# EAGLE design SLA_1500_CAM_V4 (EAGLE 9.2.1)
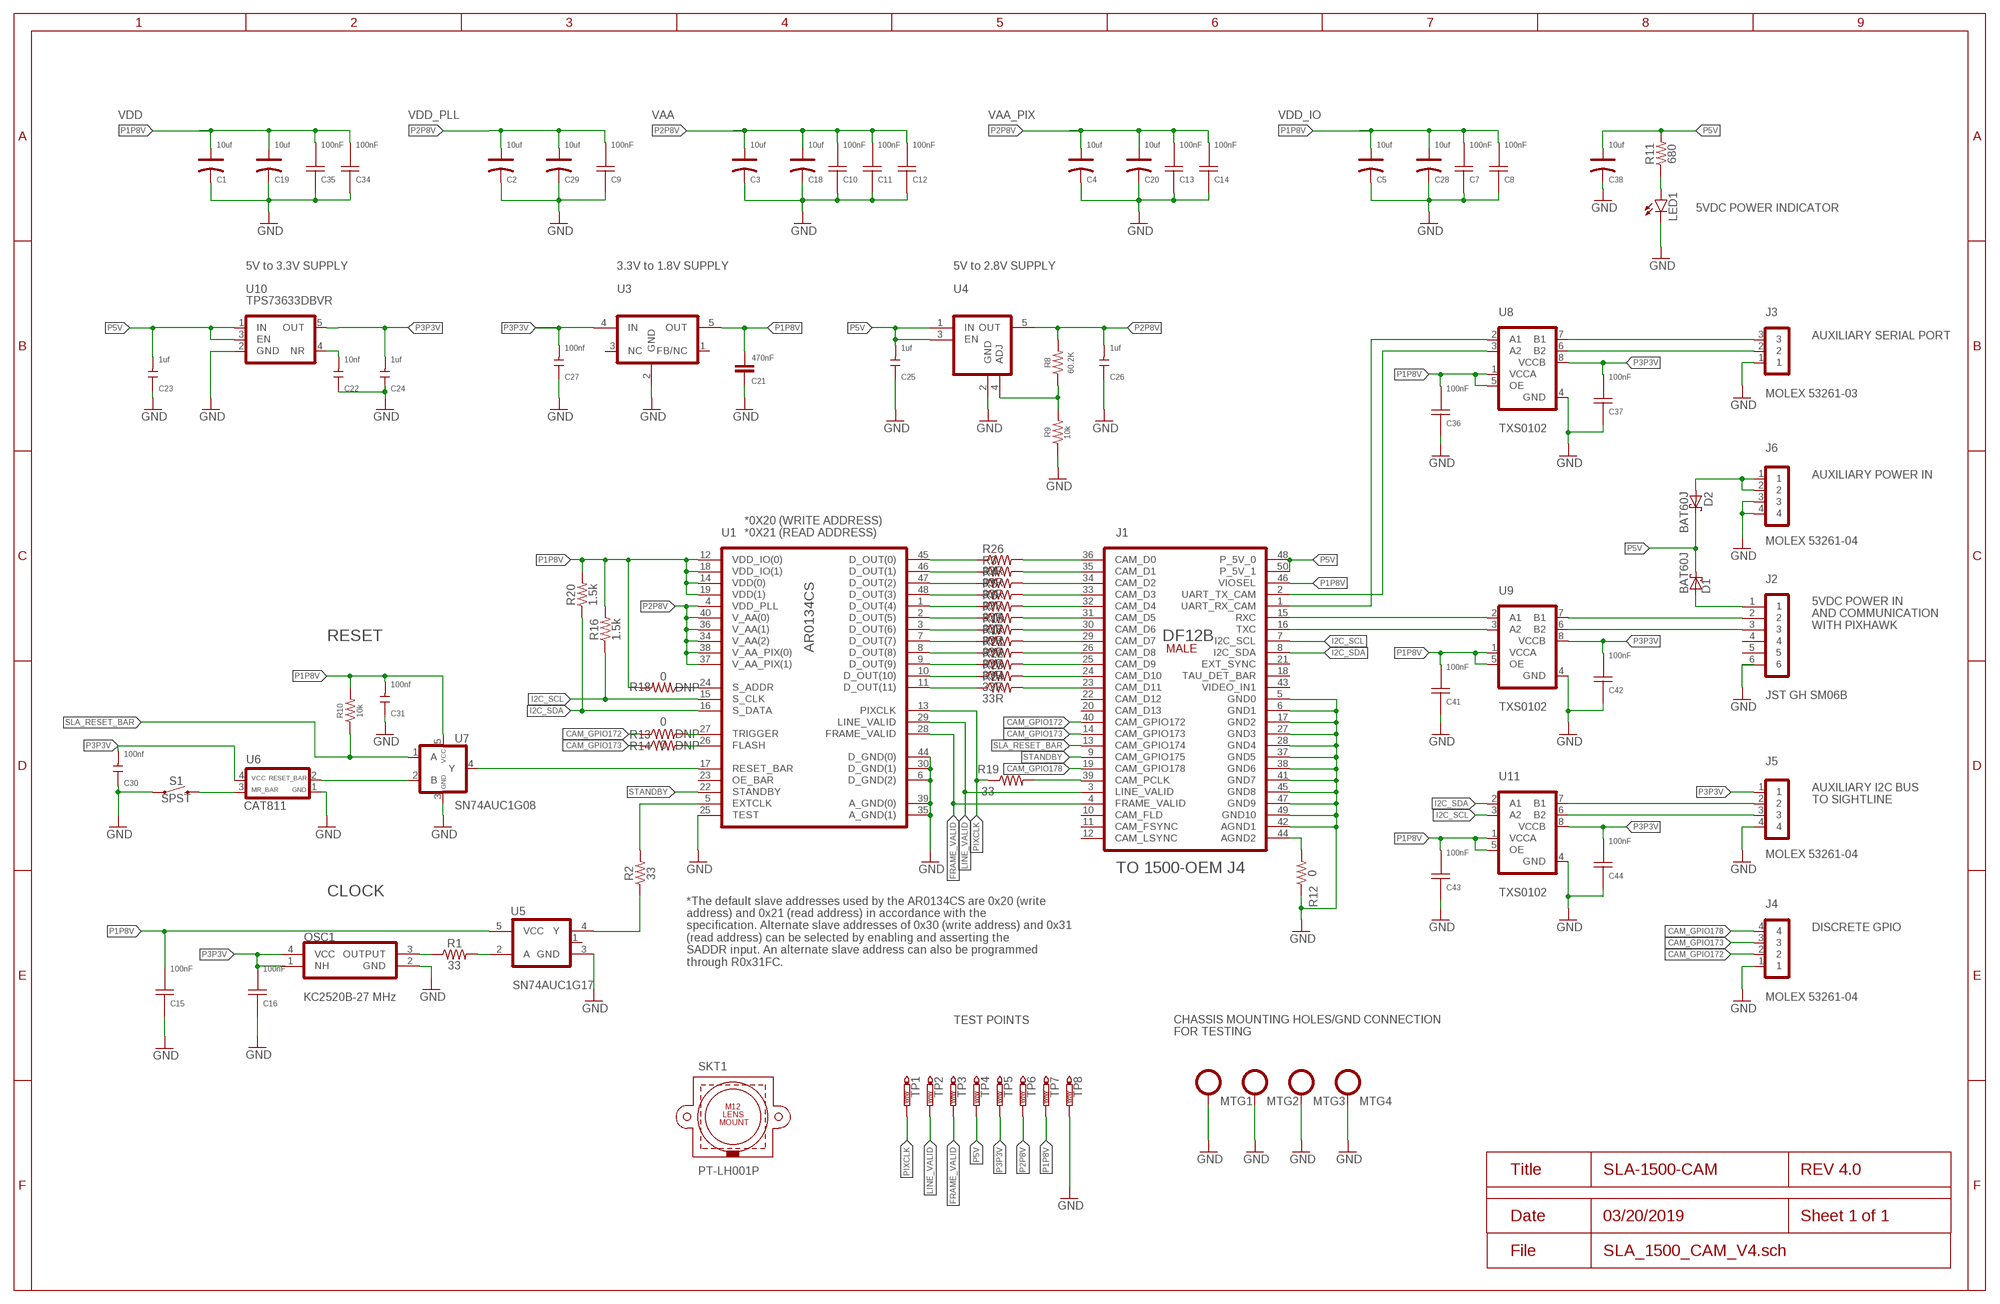
[diagram p0: schematic, sheet 1]
FRAME1 (FRAME_B_L): SPICEPREFIX: X

## Parts
C1  10uf  TANTALUM-SMD-10UF-10V-10%(AVX-A)  [AVX-A]
C2  10uf  TANTALUM-SMD-10UF-10V-10%(AVX-A)  [AVX-A]
C3  10uf  TANTALUM-SMD-10UF-10V-10%(AVX-A)  [AVX-A]
C4  10uf  TANTALUM-SMD-10UF-10V-10%(AVX-A)  [AVX-A]
C5  10uf  TANTALUM-SMD-10UF-10V-10%(AVX-A)  [AVX-A]
C7  CAP0201100NF  [R0201]
C8  CAP0201100NF  [R0201]
C9  CAP0201100NF  [R0201]
C10  CAP0201100NF  [R0201]
C11  CAP0201100NF  [R0201]
C12  CAP0201100NF  [R0201]
C13  CAP0201100NF  [R0201]
C14  CAP0201100NF  [R0201]
C15  CAP0201100NF  [R0201]
C16  CAP0201100NF  [R0201]
C18  10uf  TANTALUM-SMD-10UF-10V-10%(AVX-A)  [AVX-A]
C19  10uf  TANTALUM-SMD-10UF-10V-10%(AVX-A)  [AVX-A]
C20  10uf  TANTALUM-SMD-10UF-10V-10%(AVX-A)  [AVX-A]
C21  470nF  470NF-0402-16V-10%  [0402]
C22  10nf  CERAMIC-10NF-50V-10%-X7R(0402)  [C0402]
C23  1uf  CERAMIC-1UF-10V-10%-X5R(0402)  [C0402]
C24  1uf  CERAMIC-1UF-10V-10%-X5R(0402)  [C0402]
C25  1uf  CERAMIC-1UF-10V-10%-X5R(0402)  [C0402]
C26  1uf  CERAMIC-1UF-10V-10%-X5R(0402)  [C0402]
C27  100nf  CERAMIC-100NF-25V-10%-X7R(0402)  [C0402]
C28  10uf  TANTALUM-SMD-10UF-10V-10%(AVX-A)  [AVX-A]
C29  10uf  TANTALUM-SMD-10UF-10V-10%(AVX-A)  [AVX-A]
C30  100nf  CERAMIC-100NF-25V-10%-X7R(0402)  [C0402]
C31  100nf  CERAMIC-100NF-25V-10%-X7R(0402)  [C0402]
C34  CAP0201100NF  [R0201]
C35  CAP0201100NF  [R0201]
C36  CAP0201100NF  [R0201]
C37  CAP0201100NF  [R0201]
C38  10uf  TANTALUM-SMD-10UF-10V-10%(AVX-A)  [AVX-A]
C41  CAP0201100NF  [R0201]
C42  CAP0201100NF  [R0201]
C43  CAP0201100NF  [R0201]
C44  CAP0201100NF  [R0201]
D1  BAT60J  [SOD323_ST]
D2  BAT60J  [SOD323_ST]
J1  DF12B(5.0)-50DS-0.5(86)SMT  [DF12B(5.0)-50DS-0.5V(86)]
J2  JST GH SM06B  JST_GH_SM06B-GHS-TB  [JST_SM06B-GHS-TB]
J3  MOLEX 53261-03  MOLEX53261-03  [53261-03]
J4  MOLEX 53261-04  MOLEX53261-04  [53261-04]
J5  MOLEX 53261-04  MOLEX53261-04  [53261-04]
J6  MOLEX 53261-04  MOLEX53261-04  [53261-04]
LED1  LEDCHIP-LED0603  [CHIP-LED0603]
MTG1  SLA_MOUNTING  [SLA_MOUNTING]
MTG2  SLA_MOUNTING  [SLA_MOUNTING]
MTG3  SLA_MOUNTING  [SLA_MOUNTING]
MTG4  SLA_MOUNTING  [SLA_MOUNTING]
OSC1  KC2520B-27MHZ  [2.5X2.0_SMDCRYSTAL]
R1  33  RESISTOR0402  [0402]
R2  33  RESISTOR0402  [0402]
R3  33R  R-US_R0201  [R0201]
R4  33R  R-US_R0201  [R0201]
R5  33R  R-US_R0201  [R0201]
R6  33R  R-US_R0201  [R0201]
R7  33R  R-US_R0201  [R0201]
R8  60.2K  62KOHM-0603-1/10W-5%  [0603]
R9  10k  10KOHM-0603-1/10W-1%  [0603]
R10  10k  10KOHM-0603-1/10W-1%  [0603]
R11  680  680OHM-0603-1/10W-5%  [0603]
R12  0  RESISTOR0402  [0402]
R13  0  RESISTOR0402  [0402]
R14  0  RESISTOR0402  [0402]
R15  33R  R-US_R0201  [R0201]
R16  1.5k  1.5KOHM-0603-1/10W-1%  [0603]
R17  33R  R-US_R0201  [R0201]
R18  0  RESISTOR0402  [0402]
R19  33  RESISTOR0402  [0402]
R20  1.5k  1.5KOHM-0603-1/10W-1%  [0603]
R21  33R  R-US_R0201  [R0201]
R22  33R  R-US_R0201  [R0201]
R23  33R  R-US_R0201  [R0201]
R24  33R  R-US_R0201  [R0201]
R26  33R  R-US_R0201  [R0201]
S1  SPST  MOMENTARY-SWITCH-SPST-SMD-4.6X2.8MM  [TACTILE_SWITCH_SMD_4.6X2.8MM]
SKT1  PT-LH001P  M12_LENS_MOUNT  [M12_HOLDER]
TP1  PTR1PAD1-13  [P1-13]
TP2  PTR1PAD1-13  [P1-13]
TP3  PTR1PAD1-13  [P1-13]
TP4  PTR1PAD1-13  [P1-13]
TP5  PTR1PAD1-13  [P1-13]
TP6  PTR1PAD1-13  [P1-13]
TP7  PTR1PAD1-13  [P1-13]
TP8  PTR1PAD1-13  [P1-13]
U1  AR0134CS-ILCC48  [ILCC48_KD]
U3  TPS71518DCKR  [TI-SC70-5]
U4  AP7331-WG-7  [SOT-25]
U5  SN74AUC1G17  [SOT23-5]
U6  CAT811  [SOT-143-4]
U7  SN74AUC1G08  [SOT23-5]
U8  TXS0102  TXS0102DQM  [X2SON(8)1.8X1.2MM]
U9  TXS0102  TXS0102DQM  [X2SON(8)1.8X1.2MM]
U10  TPS73633DBVR  [SOT23-5]
U11  TXS0102  TXS0102DQM  [X2SON(8)1.8X1.2MM]

## Nets
CAM_GPIO172: J1.40(CAM_GPIO172) J4.2 R13.1
CAM_GPIO173: J1.14(CAM_GPIO173) J4.3 R14.1
CAM_GPIO178: J1.19(CAM_GPIO178) J4.4
FRAME_VALID: J1.4(FRAME_VALID) TP3.TP U1.28(FRAME_VALID)
GND: C1.- C2.- C3.- C4.- C5.- C7.2 C8.2 C9.2 C10.2 C11.2 C12.2 C13.2 C14.2 C15.2 C16.2 C18.- C19.- C20.- C21.2 C22.1 C23.1 C24.1 C25.1 C26.1 C27.1 C28.- C29.- C30.1 C31.1 C34.2 C35.2 C36.2 C37.2 C38.- C41.2 C42.2 C43.2 C44.2 J1.5(GND0) J1.6(GND1) J1.17(GND2) J1.27(GND3) J1.28(GND4) J1.37(GND5) J1.38(GND6) J1.41(GND7) J1.42(AGND1) J1.45(GND8) J1.47(GND9) J1.49(GND10) J2.6 J3.1 J4.1 J5.4 J6.3 J6.4 LED1.C MTG1.P$1 MTG2.P$1 MTG3.P$1 MTG4.P$1 OSC1.2(GND) R9.1 R12.1 S1.1 S1.2 TP8.TP U1.6(D_GND(2)) U1.25(TEST) U1.30(D_GND(1)) U1.35(A_GND(1)) U1.39(A_GND(0)) U1.44(D_GND(0)) U3.2(GND) U4.2(GND) U5.3(GND) U6.1(GND) U7.3(GND) U8.4(GND) U9.4(GND) U10.2(GND) U11.4(GND)
I2C_SCL: J1.7(I2C_SCL) R16.1 U1.15(S_CLK) U11.3(A2)
I2C_SDA: J1.8(I2C_SDA) R20.1 U1.16(S_DATA) U11.2(A1)
LINE_VALID: J1.3(LINE_VALID) TP2.TP U1.29(LINE_VALID)
N$1: J2.3 U9.6(B2)
N$2: R26.1 U1.45(D_OUT(0))
N$3: J1.36(CAM_D0) R26.2
N$4: R3.1 U1.46(D_OUT(1))
N$5: J1.35(CAM_D1) R3.2
N$6: R4.1 U1.47(D_OUT(2))
N$7: J1.34(CAM_D2) R4.2
N$8: R5.1 U1.48(D_OUT(3))
N$9: J1.33(CAM_D3) R5.2
N$10: R6.1 U1.1(D_OUT(4))
N$11: J1.32(CAM_D4) R6.2
N$12: R7.1 U1.2(D_OUT(5))
N$13: J3.3 U8.7(B1)
N$14: J1.31(CAM_D5) R7.2
N$15: R1.2 U5.2(A)
N$16: OSC1.3(OUTPUT) R1.1
N$17: J2.2 U9.7(B1)
N$18: J3.2 U8.6(B2)
N$19: J1.1(UART_RX_CAM) U8.2(A1)
N$20: J1.2(UART_TX_CAM) U8.3(A2)
N$21: C22.2 U10.4(NR)
N$22: R15.1 U1.3(D_OUT(6))
N$23: R8.1 R9.2 U4.4(ADJ)
N$24: J1.30(CAM_D6) R15.2
N$25: R2.1 U5.4(Y)
N$26: R2.2 U1.5(EXTCLK)
N$27: S1.3 S1.4 U6.3(MR_BAR)
N$28: U6.2(RESET_BAR) U7.2(B)
N$29: U1.17(RESET_BAR) U7.4(Y)
N$30: LED1.A R11.1
N$31: J1.44(AGND2) R12.2
N$32: R13.2 U1.27(TRIGGER)
N$33: R14.2 U1.26(FLASH)
N$34: D1.A J2.1
N$35: J1.15(RXC) U9.2(A1)
N$36: J1.16(TXC) U9.3(A2)
N$37: J5.2 U11.7(B1)
N$38: J5.3 U11.6(B2)
N$39: D2.A J6.1 J6.2
N$40: R17.1 U1.7(D_OUT(7))
N$41: J1.29(CAM_D7) R17.2
N$42: R21.1 U1.8(D_OUT(8))
N$43: J1.26(CAM_D8) R21.2
N$44: R22.1 U1.9(D_OUT(9))
N$45: J1.25(CAM_D9) R22.2
N$46: R23.1 U1.10(D_OUT(10))
N$47: J1.24(CAM_D10) R23.2
N$48: R24.1 U1.11(D_OUT(11))
N$49: J1.23(CAM_D11) R24.2
N$52: R18.1 U1.24(S_ADDR)
N$53: J1.39(CAM_PCLK) R19.2
P1P8V: C1.+ C5.+ C7.1 C8.1 C15.1 C19.+ C21.1 C28.+ C31.2 C34.1 C35.1 C36.1 C41.1 C43.1 J1.46(VIOSEL) R10.2 R16.2 R18.2 R20.2 TP7.TP U1.12(VDD_IO(0)) U1.14(VDD(0)) U1.18(VDD_IO(1)) U1.19(VDD(1)) U3.5(OUT) U5.5(VCC) U7.5(VCC) U8.1(VCCA) U8.5(OE) U9.1(VCCA) U9.5(OE) U11.1(VCCA) U11.5(OE)
P2P8V: C2.+ C3.+ C4.+ C9.1 C10.1 C11.1 C12.1 C13.1 C14.1 C18.+ C20.+ C26.2 C29.+ R8.2 TP6.TP U1.4(VDD_PLL) U1.34(V_AA(2)) U1.36(V_AA(1)) U1.37(V_AA_PIX(1)) U1.38(V_AA_PIX(0)) U1.40(V_AA(0)) U4.5(OUT)
P3P3V: C16.1 C24.2 C27.2 C30.2 C37.1 C42.1 C44.1 J5.1 OSC1.1(NH) OSC1.4(VCC) TP5.TP U3.4(IN) U6.4(VCC) U8.8(VCCB) U9.8(VCCB) U10.5(OUT) U11.8(VCCB)
P5V: C23.2 C25.2 C38.+ D1.C D2.C J1.48(P_5V_0) J1.50(P_5V_1) R11.2 TP4.TP U4.1(IN) U4.3(EN) U10.1(IN) U10.3(EN)
PIXCLK: R19.1 TP1.TP U1.13(PIXCLK)
SLA_RESET_BAR: J1.13(CAM_GPIO174) R10.1 U7.1(A)
STANDBY: J1.9(CAM_GPIO175) U1.22(STANDBY)
Unconnected: J1.10(CAM_FLD) J1.11(CAM_FSYNC) J1.12(CAM_LSYNC) J1.18(TAU_DET_BAR) J1.20(CAM_D13) J1.21(EXT_SYNC) J1.22(CAM_D12) J1.43(VIDEO_IN1) J2.4 J2.5 U1.23(OE_BAR) U3.1(FB/NC) U3.3(NC) U5.1(NC)

## Notes on the sheet
- VDD | VDD_PLL | VAA | VAA_PIX | VDD_IO
- 5VDC POWER INDICATOR
- 5V to 3.3V SUPPLY | 3.3V to 1.8V SUPPLY | 5V to 2.8V SUPPLY
- AUXILIARY SERIAL PORT
- AUXILIARY POWER IN
- *0X20 (WRITE ADDRESS)
  *0X21 (READ ADDRESS)
- 5VDC POWER IN 
  AND COMMUNICATION 
  WITH PIXHAWK
- RESET
- DNP
- DNP
- DNP
- AUXILIARY I2C BUS 
  TO SIGHTLINE
- TO 1500-OEM J4
- CLOCK
- DISCRETE GPIO
- *The default slave addresses used by the AR0134CS are 0x20 (write
  address) and 0x21 (read address) in accordance with the
  specification. Alternate slave addresses of 0x30 (write address) and 0x31 
  (read address) can be selected by enabling and asserting the
  SADDR input. An alternate slave address can also be programmed
  through R0x31FC.
- TEST POINTS
- CHASSIS MOUNTING HOLES/GND CONNECTION
  FOR TESTING

## Library data of the parts
C1-C5 C18-C20 C28 C29 C38 = Seeed-Capacitor:TANTALUM-SMD-10UF-10V-10%(AVX-A): 302020011; MPN: TAJA106K010RNJ
C7-C16 C34-C37 C41-C44 = Sightline:CAP0201: CAP0201 PANASONIC CERAMIC CAPACITOR CAP, CERAMIC, 100nF, 10V, X5R, 20%, 0201; DESCRIPTION: CAP, CERAMIC, 100nF, 10V, X5R, 20%, 0201; MANF: PANASONIC; MANF#: ECJZEB1A104M
C21 = SparkFun-Capacitors:470NF: 0.47uF/470nF ceramic capacitors A capacitor is a passive two-terminal electrical component used to store electrical energy temporarily in an electric field.; PROD_ID: CAP-09041
C22 = Seeed-Capacitor:CERAMIC-10NF-50V-10%-X7R(0402): 302010006; MPN: CC0402KRX7R9BB103
C23-C26 = Seeed-Capacitor:CERAMIC-1UF-10V-10%-X5R(0402): 302010040; MPN: CC0402KRX5R6BB105
C27 C30 C31 = Seeed-Capacitor:CERAMIC-100NF-25V-10%-X7R(0402): 302010024; MPN: CC0402KRX7R8BB104
D1 D2 = diode:BAT60J: Schottky barrier diode Source: www.st.com, BAT60J.pdf
J1 = Sightline:DF12B(5.0)-50DS-0.5(86): DF12B(5.0)-50DS-0.5(86) DF12 Series 0.5 mm Pitch SMT Board-to-Board Connector (MALE) Specifications Manufacturer: Hirose Manufacturer Part Number: 537-0309-6 86 Operating Temperature Range(C): -45 - 125 Current Rating: 0.3A Voltage Rating: 50V AC Body Size(mm): 14.6 x 3.6 DF12B(5.0)-50DS DATASHEET <https://www.hirose.com/product/en/products/DF12/> Created by: Kimball S. Davis kimball4@pdx.edu <mailto: kimball4@pdx.edu> 21 January 2019 Version 001; DESCRIPTION: DF12B-50DS-0.5V(86) Hirose Male 50-pin connector; MANF: Hirose; MANF#: 537-0309-6 86
J2 = Sightline:JST_GH_SM06B-GHS-TB: JST SM06B-GHS-TB JST Type GH 1.25mm side-entry smt 6-pin connector Specifications Manufacturer: JST Manufacturer Part Number: SM06B-GHS-TB Body Size(mm): 10.75 X 4.25 JST TYPE GH DATASHEET <http://www.jst-mfg.com/product/pdf/eng/eGH.pdf> Created by: Kimball S. Davis 5 February 2019 Version 001; DESCRIPTION: 1.25 MM SIDE-ENTRY 6-PIN SMT CONNECTOR; MANF: JST; MANF#: SM06B-GHS-TB
J3 = Sightline:MOLEX53261-03: MOLEX 53261-03 1.25mm Pitch PicoBlade Header, Surface Mount, Right-Angle, 3 Circuits, Tin (Sn) Plating 53261-03 DATASHEET <https://www.molex.com/webdocs/datasheets/pdf/en-us/0532610371_PCB_HEADERS.pdf>; DESCRIPTION: 1.25mm Pitch PicoBlade Header, Surface Mount, Right-Angle, 3 Circuits, Tin (Sn) Plating; MANF: MOLEX; MANF#: 532610371
J4-J6 = Sightline:MOLEX53261-04: MOLEX 53261-04 1.25mm Pitch PicoBlade Header, Surface Mount, Right-Angle, 4 Circuits, Tin (Sn) Plating 53261-04 DATASHEET <https://www.molex.com/webdocs/datasheets/pdf/en-us/0532610471_PCB_HEADERS.pdf>; DESCRIPTION: 1.25mm Pitch PicoBlade Header, Surface Mount, Right-Angle, 4 Circuits, Tin (Sn) Plating; MANF: MOLEX; MANF#: 532610471
LED1 = led:LED: LED OSRAM: - CHIPLED LG R971, LG N971, LY N971, LG Q971, LY Q971, LO R971, LY R971 LH N974, LH R974 LS Q976, LO Q976, LY Q976 LO Q996 - Hyper CHIPLED LW Q18S LB Q993, LB Q99A, LB R99A - SideLED LS A670, LO A670, LY A670, LG A670, LP A670 LB A673, LV A673, LT A673, LW A673 LH A674 LY A675 LS A676, LA A676, LO A676, LY A676, LW A676 LS A679, LY A679, LG A679 - Hyper Micro SIDELED® LS Y876, LA Y876, LO Y876, LY Y876 LT Y87S - SmartLED LW L88C, LW L88S LB L89C, LB L89S, LG L890 LS L89K, LO L89K, LY L89K LS L896, LA L896, LO L896, LY L896 - TOPLED LS T670, LO T670, LY T670, LG T670, LP T670 LSG T670, LSP T670, LSY T670, LOP T670, LYG T670 LG T671, LOG T671, LSG T671 LB T673, LV T673, LT T673, LW T673 LH T674 LS T676, LA T676, LO T676, LY T676, LB T676, LH T676, LSB T676, LW T676 LB T67C, LV T67C, LT T67C, LS T67K, LO T67K, LY T67K, LW E67C LS E67B, LA E67B, LO E67B, LY E67B, LB E67C, LV E67C, LT E67C LW T67C LS T679, LY T679, LG T679 LS T770, LO T770, LY T770, LG T770, LP T770 LB T773, LV T773, LT T773, LW T773 LH T774 LS E675, LA E675, LY E675, LS T675 LS T776, LA T776, LO T776, LY T776, LB T776 LHGB T686 LT T68C, LB T68C - Hyper Mini TOPLED® LB M676 - Mini TOPLED Santana® LG M470 LS M47K, LO M47K, LY M47K Source: http://www.osram.convergy.de LUXEON: - LUMILED® LXK2-PW12-R00, LXK2-PW12-S00, LXK2-PW14-U00, LXK2-PW14-V00 LXK2-PM12-R00, LXK2-PM12-S00, LXK2-PM14-U00 LXK2-PE12-Q00, LXK2-PE12-R00, LXK2-PE12-S00, LXK2-PE14-T00, LXK2-PE14-U00 LXK2-PB12-K00, LXK2-PB12-L00, LXK2-PB12-M00, LXK2-PB14-N00, LXK2-PB14-P00, LXK2-PB14-Q00 LXK2-PR12-L00, LXK2-PR12-M00, LXK2-PR14-Q00, LXK2-PR14-R00 LXK2-PD12-Q00, LXK2-PD12-R00, LXK2-PD12-S00 LXK2-PH12-R00, LXK2-PH12-S00 LXK2-PL12-P00, LXK2-PL12-Q00, LXK2-PL12-R00 Source: www.luxeon.com KINGBRIGHT: KA-3528ASYC Source: www.kingbright.com
MTG1-MTG4 = Sightline:SLA_MOUNTING
OSC1 = Sightline:KC2520B-27MHZ: KC2520B-27MHz-2.5X2.0 27 MHz SMT Clock Oscillator with CMOS output Specifications Manufacturer: Kyocera Manufacturer Part Number: KC2520B27.0000C2GE00 Supply Voltage: 1.8 to 3.3V Body Size(mm): 2.5 x 2.0 KC2520B DATASHEET <https://www.mouser.com/datasheet/2/909/kc2520b_c1_e-1388834.pdf> Created by: Kimball S. Davis 25 January 2019 Version 001; DESCRIPTION: OSC, CRYSTAL CLOCK, SMD, CMOS, 2.25V TO 3.63V, 4mA, 27.0000MHz, 2.5MM x 2.0MM; MANF: Kyocera; MANF#: KC2520B27.0000C2GE00
R1 R2 R12-R14 R18 R19 = SparkFun-Resistors:RESISTOR: Generic Resistor Package
R3-R7 R15 R17 R21-R24 R26 = resistor:R-US_: RESISTOR, American symbol
R8 = SparkFun-Resistors:62KOHM: 62kΩ resistor A resistor is a passive two-terminal electrical component that implements electrical resistance as a circuit element. Resistors act to reduce current flow, and, at the same time, act to lower voltage levels within circuits. - Wikipedia
R9 R10 = SparkFun-Resistors:10KOHM: 10kΩ resistor A resistor is a passive two-terminal electrical component that implements electrical resistance as a circuit element. Resistors act to reduce current flow, and, at the same time, act to lower voltage levels within circuits. - Wikipedia; PROD_ID: RES-00824
R11 = SparkFun-Resistors:680OHM: 680Ω resistor A resistor is a passive two-terminal electrical component that implements electrical resistance as a circuit element. Resistors act to reduce current flow, and, at the same time, act to lower voltage levels within circuits. - Wikipedia; PROD_ID: RES-09333
R16 R20 = SparkFun-Resistors:1.5KOHM: 1.5kΩ resistor A resistor is a passive two-terminal electrical component that implements electrical resistance as a circuit element. Resistors act to reduce current flow, and, at the same time, act to lower voltage levels within circuits. - Wikipedia; PROD_ID: RES-08306
S1 = SparkFun-Switches:MOMENTARY-SWITCH-SPST: Momentary Switch (Pushbutton) - SPST Normally-open (NO) SPST momentary switches (buttons, pushbuttons). Variants PTH-12MM - 12mm square, through-hole Momentary Pushbutton Switch - 12mm Square <https://www.sparkfun.com/products/9190> (COM-09190) PTH-6.0MM, PTH-6.0MM-KIT - 6.0mm square, through-hole Mini Pushbutton Switch <https://www.sparkfun.com/products/97> (COM-00097) KIT package intended for soldering kit's - only one side of pads' copper is exposed. PTH-RIGHT-ANGLE-KIT - Right-angle, through-hole Right Angle Tactile Button <https://www.sparkfun.com/products/10791> - Used on SparkFun BigTime Watch Kit <https://www.sparkfun.com/products/11734> SMD-12MM - 12mm square, surface-mount Tactile Button - SMD (12mm) <https://www.sparkfun.com/products/12993> (COM-12993) Used on SparkFun PicoBoard <https://www.sparkfun.com/products/11888> SMD-4.5MM - 4.5mm Square Trackball Switch Used on SparkFun Blackberry Trackballer Breakout <https://www.sparkfun.com/products/13169> SMD-4.6MMX2.8MM - 4.60mm x 2.80mm, surface mount Used on SparkFun SAMD21 Mini Breakout <https://www.sparkfun.com/products/13664> SMD-5.2MM, SMD-5.2-REDUNDANT - 5.2mm square, surface-mount Mini Pushbutton Switch - SMD <https://www.sparkfun.com/products/8720> (COM-08720) Used on Arduino Pro Mini <https://www.sparkfun.com/products/11114> REDUNDANT package connects both switch circuits together SMD-6.0X3.5MM - 6.0 x 3.5mm, surface mount Momentary Reset Switch SMD <https://www.sparkfun.com/products/8229> (COM-08229) SMD-6.2MM-TALL - 6.2mm square, surface mount Tactile Button - SMD (6mm) <https://www.sparkfun.com/products/12992> Used on SparkFun Digital Sandbox <https://www.sparkfun.com/products/12651> SMD-RIGHT-ANGLE - Right-angle, surface mount Used on SparkFun Block for Intel® Edison - Arduino <https://www.sparkfun.com/products/13036>; PROD_ID: SWCH-13065
SKT1 = Sightline:M12_LENS_MOUNT: PT-LH001P PT-LH001P Plastic M12 Lens Holder, 20mm Hole Spacing; DESCRIPTION: PT-LH001P Plastic M12 Lens Holder, 20mm Hole Spacing; MANF: M12 LENSES; MANF#: PT-LH001P
TP1-TP8 = testpad:PTR1: TEST PIN
U1 = Sightline:AR0134CS-ILCC48: AR0134CS-1LCC48-10x10 1/3-inch 1.2 Mp CMOS digital image sensor with an active-pixel array of 1280 (H) × 960 (V) Specifications Manufacturer: On Semiconductor Manufacturer Part Number: AR0134CSSM00SPCA0 Operating Temperature Range(C): -30 - 70 Supply Voltage: I/O: 1.8 or 2.8V Digital: 1.8V Analog: 2.8V HiSPi: 0.4V Body Size(mm): 10 x 10 ARO134CS DATASHEET <https://www.onsemi.com/pub/Collateral/AR0134CS-D.PDF> Created by: Kimball S. Davis kimball4@pdx.edu <mailto: kimball4@pdx.edu> 22 January 2019 Version 001; DESCRIPTION: 1/3-inch 1.2 Mp CMOS digital image sensor with an active-pixel array of 1280 (H) × 960 (V); MANF: On Semiconductor; MANF#: AR0134CSSM00SPCA0
U3 = Sightline:TPS71518DCKR: TPS71518DCKR 50-mA, 24-V, 3.2-μA Supply Current Low-Dropout Linear Regulator in SC70 5-Pin Package, 3.3 to 1.8V, 2.15 x 1.4mm TPS71518DCKR DATASHEET <http://www.ti.com/lit/ds/symlink/tps715.pdf>; DESCRIPTION: 50-mA, 24-V, 3.2-μA Supply Current Low-Dropout Linear Regulator in SC70 5-Pin Package, 3.3 to 1.8V, 2.15 x 1.4mm; MANF: TEXAS INSTRUMENTS; MANF#: TPS71518DCKR
U4 = Sightline:AP7331-WG-7: AP7331-WG-7 300mA, LOW QUIESCENT CURRENT, FAST TRANSIENT LOW DROPOUT LINEAR REGULATOR, ADJUSTABLE OUTPUT, 5V to 2.8V, 3.1 x 1.7mm AP7331 DATASHEET <https://www.diodes.com/assets/Datasheets/AP7331.pdf>; DESCRIPTION: 300mA, LOW QUIESCENT CURRENT, FAST TRANSIENT LOW DROPOUT LINEAR REGULATOR, ADJUSTABLE OUTPUT, 5V to 2.8V, 3.1 x 1.7mm; MANF: DIODES INCORPORATED; MANF#: AP7331-WG-7
U5 = Sightline:SN74AUC1G17: SN74AUC1G17-SOT23-5 IC, BUFFER, SINGLE SCHMITT-TRIGGER, 9mA, 0.8V TO 2.7V, SOT23-5 Specifications Manufacturer: Texas Instruments Manufacturer Part Number: SN74AUC1G17DBVR Supply Voltage: 3.6V Max Body Size(mm): 2.9 x 1.6 SN74AUC1G17 DATASHEET <http://www.ti.com/lit/ds/symlink/sn74auc1g17.pdf> Created by: Kimball S. Davis 24 January 2019 Version 001; DESCRIPTION: IC, BUFFER, SINGLE SCHMITT-TRIGGER, 9mA, 0.8V TO 2.7V, SOT23-5; MANF: TEXAS INSTRUMENTS; MANF#: SN74AUC1G17DBV
U6 = Sightline:CAT811: CAT811-SOT-143-4 IC, SUPERVISOR, MICROPROCESSOR POWER SUPPLY, 2.93V, ACTIVE LOW RESET, SOT143-4 Specifications Manufacturer: On Semiconductor Manufacturer Part Number: CAT811STBI Body Size(mm): 2.9 x 1.3 CAT811 DATASHEET <https://www.onsemi.com/pub/Collateral/CAT811-D.PDF> Created by: Kimball S. Davis 23 January 2019 Version 001; DESCRIPTION: IC, SUPERVISOR, MICROPROCESSOR POWER SUPPLY, 2.93V, ACTIVE LOW RESET, SOT143-4; MANF: On Semiconductor; MANF#: CAT811STBI
U7 = Sightline:SN74AUC1G08: SN74AUC1G08-SOT23-5 Single 2-Input Positive-AND Gate Specifications Manufacturer: Texas Instruments Manufacturer Part Number: SN74AUC1G08DBVR Supply Voltage: 1.65 - 1.95V Body Size(mm): 2.9 x 1.6 SN74AUC1G08 DATASHEET <http://www.ti.com/lit/ds/symlink/sn74auc1g08.pdf>; DESCRIPTION: IC, AND GATE, SINGLE, 2 INPUT POSITIVE, SGL, SOT23-5; MANF: Texas Instruments; MANF#: SN74AUC1G08DBVR
U8 U9 U11 = Sightline:TXS0102DQM: TXS0102DQM 1.8 X 1.2 mm TXS0102 2-Bit Bidirectional Voltage-Level Translator TXS0102 DATASHEET <http://www.ti.com/lit/ds/symlink/txs0102.pdf>; DESCRIPTION: TXS0102 2-Bit Bidirectional Voltage-Level Translator for Open-Drain and Push-Pull Applications; MANF: Texas Instruments; MANF#: TXS0102DQM
U10 = Sightline:TPS73633DBVR: TPS73633DBVR Cap-Free, NMOS, 400-mA Low-Dropout Regulator with Reverse Current Protection 5.5 to 3.3V, SOT-23 5-pin, 2.9 x 1.6 mm TPS73633DBVR DATASHEET <http://www.ti.com/lit/ds/symlink/tps736.pdf>; DESCRIPTION: Cap-Free, NMOS, 400-mA Low-Dropout Regulator with Reverse Current Protection 5.5 to 3.3V, SOT-23 5-pin, 2.9 x 1.6 mm; MANF: Texas Instruments; MANF#: TPS73633DBVR

## Board
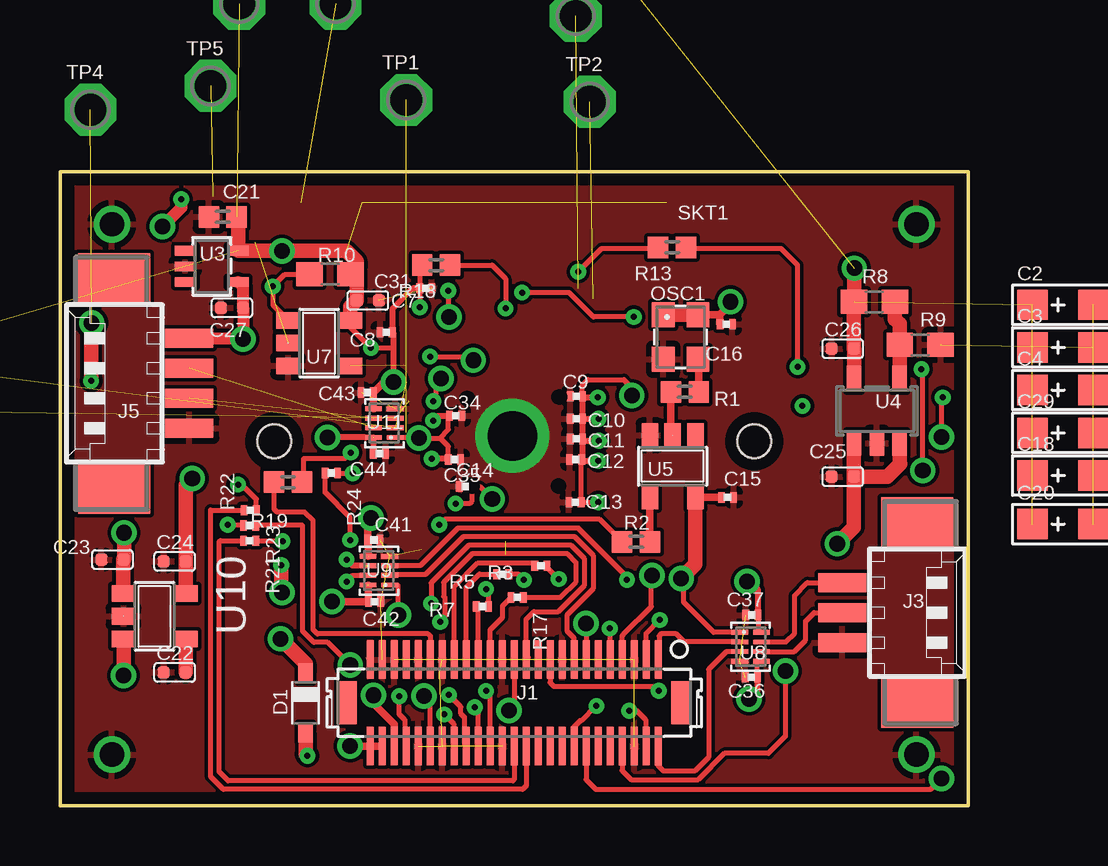
[diagram p1: board, top side]
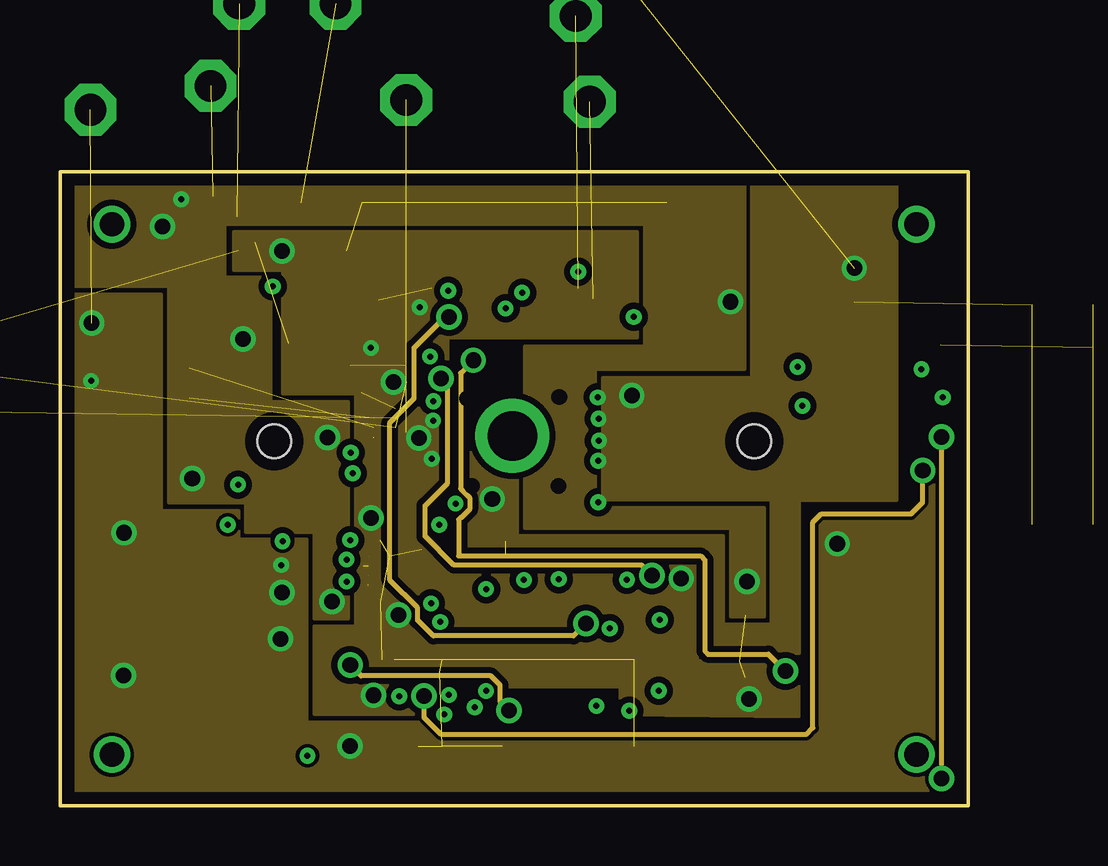
[diagram p2: board, inner layer Route2]
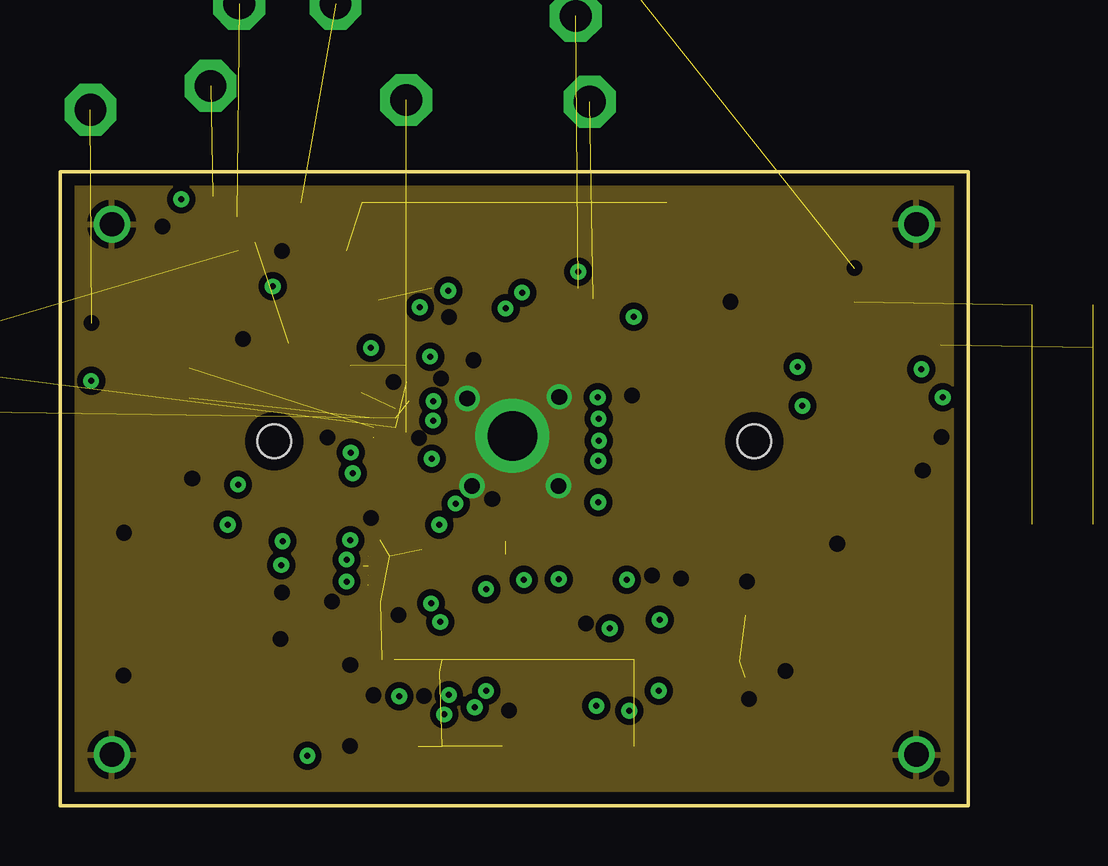
[diagram p3: board, inner layer Route15]
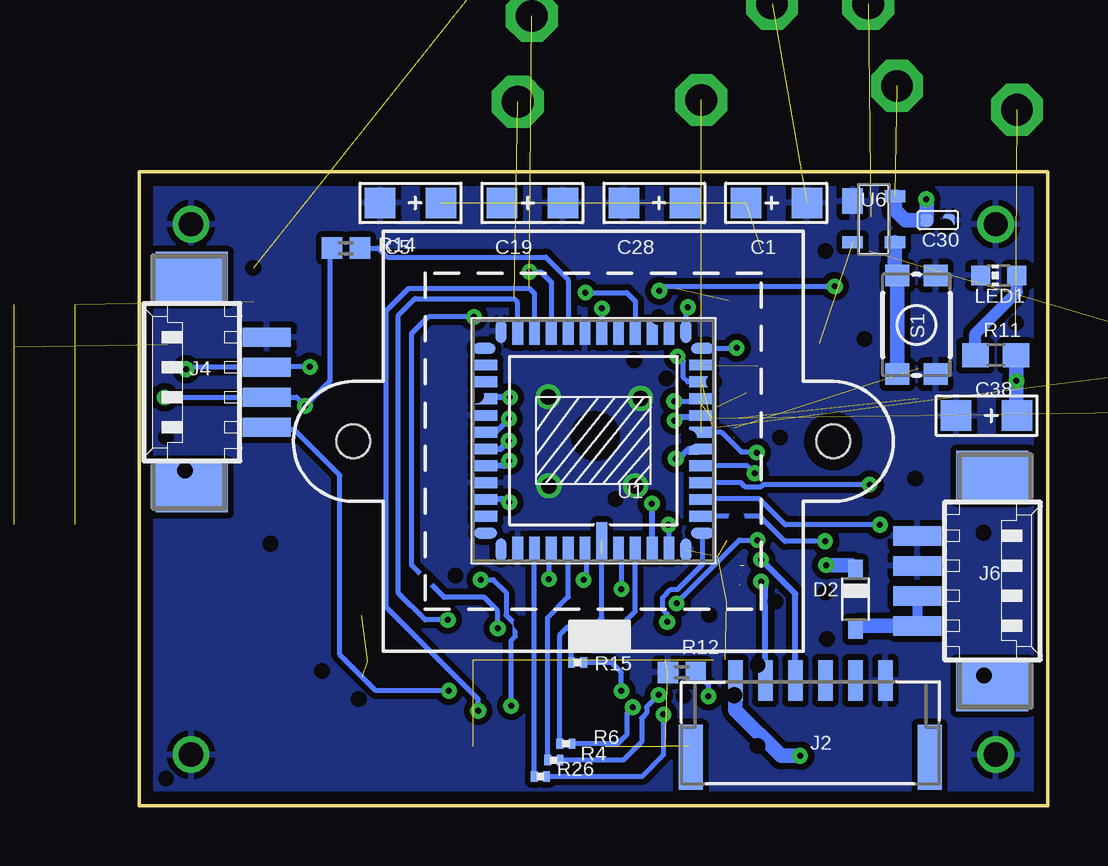
[diagram p4: board, bottom side, seen from below]

Size 37.85 x 26.42 mm. Coordinates in mm from the lower left corner, seen from the top.
Outline: 0,0 0.18,0
Outline: 0.18,0 37.85,0 37.85,26.42 0,26.42 0,0
Outline: 0,0 0.18,0
Copper layers ([2:[15:1+2*15+16:2]:15]): Top 0.0178mm / dielectric 12mil / Route2 0.0356mm / dielectric 28mil / Route15 0.0356mm / dielectric 12mil / Bottom 0.0178mm
Design rules "SSC-EAGLE-4Lyr_v1.0.0.3 *": minimum track width 6mil, minimum drill 8mil, track to track 6mil, track to pad 6mil, pad to pad 6mil, via to via 6mil, smd to smd 6mil, copper to edge 20mil, drill to drill 16mil, minimum pad ring 8mil, minimum via ring 8mil, stop-mask expansion 3mil, vias tented up to drill 0mil, thermal gap 10mil

### Footprints (pad centres in the part's own frame; a part is rotated, then mirrored left to right if it is on the bottom)
AVX-A = smd 1.27 x 1.27: + -1.27,0; - 1.27,0
R0201 = smd 0.28 x 0.43: 1 -0.255,0; 2 0.255,0
0402 = smd 0.85 x 0.9: 1 -0.58,0; 2 0.58,0
C0402 = smd 0.5 x 0.5: 1 0,0.463; 2 0,-0.463
SOD323_ST = smd 0.8 x 0.6: A 1.25,0; C -1.25,0
DF12B(5.0)-50DS-0.5V(86) = smd 1.6 x 0.3: 1 -1.8,6; 2 1.8,6; 3 -1.8,5.5; 4 1.8,5.5; 5 -1.8,5; 6 1.8,5; 7 -1.8,4.5; 8 1.8,4.5; 9 -1.8,4; 10 1.8,4; 11 -1.8,3.5; 12 1.8,3.5; 13 -1.8,3; 14 1.8,3; 15 -1.8,2.5; 16 1.8,2.5; 17 -1.8,2; 18 1.8,2; 19 -1.8,1.5; 20 1.8,1.5; 21 -1.8,1; 22 1.8,1; 23 -1.8,0.5; 24 1.8,0.5; 25 -1.8,0; 26 1.8,0; 27 -1.8,-0.5; 28 1.8,-0.5; 29 -1.8,-1; 30 1.8,-1; 31 -1.8,-1.5; 32 1.8,-1.5; 33 -1.8,-2; 34 1.8,-2; 35 -1.8,-2.5; 36 1.8,-2.5; 37 -1.8,-3; 38 1.8,-3; 39 -1.8,-3.5; 40 1.8,-3.5; 41 -1.8,-4; 42 1.8,-4; 43 -1.8,-4.5; 44 1.8,-4.5; 45 -1.8,-5; 46 1.8,-5; 47 -1.8,-5.5; 48 1.8,-5.5; 49 -1.8,-6; 50 1.8,-6 | smd 1.8 x 0.8: P$51 0,6.95; P$52 0,-6.95
JST_SM06B-GHS-TB = smd 0.6 x 1.7: 1 -3.23,1.95; 2 -1.98,1.95; 3 -0.73,1.95; 4 0.52,1.95; 5 1.77,1.95; 6 3.02,1.95 | smd 1 x 2.7: P$7 -5.08,-1.25; P$8 4.87,-1.25
53261-03 = smd 0.8 x 2: 1 1.25,-2.5; 2 0,-2.5; 3 -1.25,-2.5 | smd 2.1 x 3: S1 3.75,0.625; S2 -3.75,0.625
53261-04 = smd 0.8 x 2: 1 1.875,-2.5; 2 0.625,-2.5; 3 -0.625,-2.5; 4 -1.875,-2.5 | smd 2.1 x 3: S1 4.375,0.625; S2 -4.375,0.625
CHIP-LED0603 = smd 0.8 x 0.8: A 0,-0.75; C 0,0.75
SLA_MOUNTING = drill 1.016: P$1 0,0
2.5X2.0_SMDCRYSTAL = smd 1.05 x 0.95: 1 -0.925,-0.725; 2 0.925,-0.725; 3 0.925,0.725; 4 -0.925,0.725
0603 = smd 1.1 x 1: 1 -0.85,0; 2 0.85,0
TACTILE_SWITCH_SMD_4.6X2.8MM = smd 0.9 x 1: 1 -2.05,-0.8; 2 2.05,-0.8; 3 2.05,0.8; 4 -2.05,0.8
M12_HOLDER = hole 1.4: -10,0; 10,0
P1-13 = drill 1.321 pad 2.159 octagon: TP 0,0
ILCC48_KD = smd 0.45 x 1.6: 1 -0.35,4.2 | smd 0.45 x 1: 2 -1.05,4.5; 3 -1.75,4.5; 4 -2.45,4.5; 5 -3.15,4.5; 20 -3.15,-4.5; 21 -2.45,-4.5; 22 -1.75,-4.5; 23 -1.05,-4.5; 24 -0.35,-4.5; 25 0.35,-4.5; 26 1.05,-4.5; 27 1.75,-4.5; 28 2.45,-4.5; 29 3.15,-4.5; 44 3.15,4.5; 45 2.45,4.5; 46 1.75,4.5; 47 1.05,4.5; 48 0.35,4.5 | smd 0.45 x 0.95: 6 -3.85,4.55; 19 -3.85,-4.55; 30 3.85,-4.55; 43 3.85,4.55 | smd 0.95 x 0.45: 7 -4.55,3.85; 18 -4.55,-3.85; 31 4.55,-3.85; 42 4.5,3.85 | smd 1 x 0.45: 8 -4.5,3.15; 9 -4.5,2.45; 10 -4.5,1.75; 11 -4.5,1.05; 12 -4.5,0.35; 13 -4.5,-0.35; 14 -4.5,-1.05; 15 -4.5,-1.75; 16 -4.5,-2.45; 17 -4.5,-3.15; 32 4.5,-3.15; 33 4.5,-2.45; 34 4.5,-1.75; 35 4.5,-1.05; 36 4.5,-0.35; 37 4.5,0.35; 38 4.5,1.05; 39 4.5,1.75; 40 4.5,2.45; 41 4.5,3.15
TI-SC70-5 = smd 0.4 x 0.9: 1 -0.65,-1.1; 2 0,-1.1; 3 0.65,-1.1; 4 0.65,1.1; 5 -0.65,1.1
SOT-25 = smd 0.6 x 1.05: 1 -0.95,-1.35; 2 0,-1.35; 3 0.95,-1.35; 4 0.95,1.35; 5 -0.95,1.35
SOT23-5 = smd 0.69 x 0.99: 1 -0.95,-1.29; 2 0,-1.29; 3 0.95,-1.29; 4 0.95,1.3; 5 -0.95,1.3
SOT-143-4 = smd 1.06 x 0.85: 1 -0.76,-0.88 | smd 0.5 x 0.85: 2 0.96,-0.88; 3 0.96,0.88; 4 -0.96,0.88
X2SON(8)1.8X1.2MM = smd 0.2 x 0.7: 1 -0.6,-0.45; 2 -0.2,-0.45; 3 0.2,-0.45; 4 0.6,-0.45; 5 0.6,0.45; 6 0.2,0.45; 7 -0.2,0.45; 8 -0.6,0.45

### Placement (x,y rotation side)
C1  11.3,25.12 0 bottom
C2  41.78,20.88 0 top
C3  41.78,19.1 0 top
C4  41.78,17.32 0 top
C5  26.54,25.12 180 bottom
C7  15.24,21.56 0 top
C8  13.59,19.74 180 top
C9  21.51,17.07 180 top
C10  21.51,16.13 180 top
C11  21.51,15.29 180 top
C12  21.49,14.43 180 top
C13  21.46,12.65 180 top
C14  16.89,13.31 180 top
C15  27.81,12.85 0 top
C16  27.76,20.07 0 top
C18  41.78,13.77 0 top
C19  21.46,25.12 0 bottom
C20  41.78,11.73 0 top
C21  6.78,24.54 180 top
C22  4.78,5.56 90 top
C23  2.18,10.26 90 top
C24  4.78,10.19 90 top
C25  32.61,13.72 90 top
C26  32.61,19.05 90 top
C27  7.16,20.75 90 top
C28  16.38,25.12 180 bottom
C29  41.78,15.54 0 top
C30  4.57,24.41 270 bottom
C31  12.83,21.06 270 top
C34  16.48,16.26 0 top
C35  16.43,14.43 0 top
C36  28.8,5.36 180 top
C37  28.83,7.95 180 top
C38  2.54,16.26 180 bottom
C41  13.08,11.07 0 top
C42  13.11,8.51 0 top
C43  12.8,17.22 180 top
C44  13.31,14.68 0 top
D1  10.24,4.29 270 top
D2  8,8.61 270 bottom
J1  18.92,4.29 270 top
J2  9.78,3.28 0 bottom
J3  35.1,8.05 270 top
J4  35.03,17.65 90 bottom
J5  2.9,17.6 90 top
J6  2.92,9.37 270 bottom
LED1  2.03,22.1 90 bottom
MTG1  2.16,2.13 0 top
MTG2  35.69,2.13 0 top
MTG3  35.69,24.23 0 top
MTG4  2.16,24.23 0 top
OSC1  25.86,19.53 270 top
R1  26.03,17.25 180 top
R2  24,11 180 top
R3  20.04,10.01 180 top
R4  20.57,1.91 0 bottom
R5  18.44,9.65 180 top
R6  20.07,2.59 0 bottom
R7  17.6,8.31 180 top
R8  33.93,21.01 180 top
R9  35.84,19.2 180 top
R10  11.25,22.15 0 top
R11  2.16,18.77 0 bottom
R12  15.24,5.56 0 bottom
R13  25.5,23.27 180 top
R14  29.24,23.24 0 bottom
R15  19.58,5.97 0 bottom
R16  -8.43,16.48 0 top  (outside the outline)
R17  19.05,8.69 180 top
R18  15.67,22.53 180 top
R19  9.5,13.49 180 top
R20  -8.41,18.72 0 top  (outside the outline)
R21  7.9,11.05 180 top
R22  7.9,11.68 0 top
R23  7.92,12.32 180 top
R24  11.3,13.87 180 top
R26  21.13,1.22 0 bottom
S1  5.46,20.04 90 bottom
SKT1  18.92,15.18 0 bottom
TP1  14.43,29.41 0 top
TP2  22.07,29.34 0 top
TP3  21.49,32.92 0 top  (outside the outline)
TP4  1.27,29.01 0 top
TP5  6.27,30 0 top  (outside the outline)
TP6  21.77,36.68 0 top  (outside the outline)
TP7  7.47,33.43 0 top  (outside the outline)
TP8  11.48,33.43 0 top  (outside the outline)
U1  18.92,15.21 180 bottom
U3  6.32,22.48 270 top
U4  34.04,16.46 0 top
U5  25.53,14.15 180 top
U6  7.24,24.43 270 bottom
U7  10.79,19.28 270 top
U8  28.78,6.63 270 top
U9  13.28,9.8 90 top
U10  3.94,7.9 270 top
U11  13.51,15.95 90 top

### Tracks (layer width: path | path; a pad name or v marks a point on that pad's centre or on a via)
CAM_GPIO172  (via drill 0.25, 0.65 layers 1-2)
  Top 0.203: J1.40 15.42,4.31 v15.16,4.57 | v30.73,18.29 30.73,22.53 30.05,23.22 26.13,23.22 R13.1 | v35.95,13.97 35.95,18.13 v35.89,18.19
  Route2 0.203: v35.95,13.97 35.95,12.65 35.55,12.26 35.46,12.17 31.72,12.17 31.37,11.81 31.37,3.25 31.09,2.97 15.89,2.97 15.16,3.7 v15.16,4.57
  Bottom 0.203: v30.73,18.29 31.93,18.29 31.94,18.28 J4.2 32.54,18.29 35.89,18.29 v35.89,18.19
CAM_GPIO173  (via drill 0.25, 0.65 layers 1-2)
  Top 0.203: J1.14 21.92,1.09 22.33,0.69 36.28,0.69 v36.73,1.14 | v36.73,15.37 36.73,16.97 v36.78,17.02
  Route2 0.203: v36.73,1.14 v36.73,15.37
  Bottom 0.203: R14.1 29.84,23.27 29.9,23.27 29.9,17.7 v30.94,16.66 31.3,17.03 J4.3 36.77,17.03 v36.78,17.02
CAM_GPIO178  (via drill 0.25)
  Top 0.203: J1.19 20.42,5.13 20.57,4.98 24.76,4.98 v24.94,4.8
  Bottom 0.203: v24.94,4.8 27.99,4.8 29.49,6.3 29.49,13.77 31.39,15.67 31.8,15.67 31.91,15.78 J4.4
FRAME_VALID  (via drill 0.25)  (1 unrouted)
  Top 0.203: J1.4 24.4,2.52 24.4,3.59 24.03,3.96 v23.72,3.96
  Bottom 0.203: U1.28 21.39,19.73 21.39,21.36 21.59,21.56 26.62,21.56 27.56,20.62 27.56,8.28 23.72,4.44 v23.72,3.96
GND  (via drill 0.65 layers 15-16, 2.06 layers 1-15)  (25 unrouted)
  Top 0.508: J5.4 5.44,15.69 | C21.2 6.18,24.51
  Bottom 0.254: 6.22,10 J6.3 | J6.4 6.13,11.25 6.22,11.15
  Bottom 0.305: J2.6 6.73,5.25 | 5.35,11.18 J6.4
  Bottom 0.508: 5.46,11.29 J6.4 | S1.1 4.51,18.14 | 4.51,21.94 S1.2
  other vias: 20.78,13.34 20.8,17.04 16.97,16.97 17.17,13.34 18.85,15.42
  pour Route15 (isolate 0.254): -0.38,26.64 -0.38,-0.53 38.23,-0.53 38.23,26.9 -0.38,26.9
  pour Bottom (isolate 0.254): -0.38,26.9 38.23,26.9 38.23,-0.53 -0.38,-0.53 -0.38,-0.28
  pour Top (isolate 0.152): -0.66,27.15 -0.66,-0.79 38.51,-0.79 38.51,27.15
I2C_SCL  (via drill 0.25, 0.65 layers 1-2)  (2 unrouted)
  Top 0.203: v15.87,17.81 15.66,17.59 15.66,16.96 v15.56,16.86 | J1.7 23.42,7.08 23.49,7.15 23.49,7.16 24.64,8.31 24.64,9.58 v24.66,9.6
  Route2 0.203: v24.66,9.6 24.23,10.03 16.41,10.03 15.22,11.22 15.22,12.51 16.15,13.45 16.15,17.53 v15.87,17.81
  Bottom 0.203: v15.56,16.86 14.53,16.86 U1.15
I2C_SDA  (via drill 0.25, 0.65 layers 1-2)  (2 unrouted)
  Top 0.203: J1.8 23.42,1.47 23.8,1.09 26.59,1.09 27.69,2.19 29.52,2.19 30.22,2.89 v30.22,5.61 | v15.42,18.72 17.07,18.72 v17.22,18.57
  Route2 0.203: v17.22,18.57 16.69,18.03 16.69,13.21 17.06,12.84 17.06,12.36 16.72,12.01 16.69,12.01 16.61,11.94 16.61,10.41 26.7,10.41 26.87,10.24 26.87,6.45 26.97,6.35 26.97,6.32 29.52,6.32 v30.22,5.61
  Bottom 0.203: U1.16 15,17.66 15.18,17.84 15.18,18.54 15.35,18.72 v15.42,18.72
LINE_VALID  (via drill 0.25)  (1 unrouted)
  Top 0.203: J1.3 24.42,7.17 v24.99,7.74
  Bottom 0.203: v24.99,7.74 25.93,7.74 27.05,8.86 27.05,20.45 26.36,21.13 22.22,21.13 22.1,21.01 22.1,19.74 U1.29
N$1  (via drill 0.25)  (1 unrouted)
  Top 0.254: 12.63,10 12.19,10 v11.94,10.26
  Bottom 0.254: J2.3 10.51,8.83 v11.94,10.26
N$2
  Bottom 0.203: R26.1 21.39,10.7 U1.45
N$3  (via drill 0.25)
  Top 0.203: 16.4,2.47 J1.36 16.42,3.39 v16,3.81
  Bottom 0.203: v16,3.81 16,2.11 16.9,1.22 R26.2
N$4  (via drill 0.25)
  Top 0.203: R3.1 20.3,9.93 v20.78,9.45
  Bottom 0.203: U1.46 20.78,10.61 v20.78,9.45
N$5
  Top 0.203: 16.45,6.12 J1.35 16.42,9.13 17.41,10.12 19.67,10.12 R3.2
N$6
  Bottom 0.203: U1.47 | R4.1 20.83,7.85 19.96,8.71 U1.47
N$7  (via drill 0.25)
  Top 0.203: 16.95,2.52 J1.34 16.85,2.57 16.85,3.7 16.7,3.85 16.7,4.12 v16.2,4.62
  Bottom 0.203: v16.2,4.62 16.7,4.12 16.7,3.87 16.92,3.66 16.92,2.67 17.68,1.9 R4.2
N$8  (via drill 0.25)
  Top 0.203: v19.33,9.41 19.09,9.65 R5.1
  Bottom 0.203: v19.33,9.41 19.22,9.52 19.22,10.66 U1.48
N$9
  Top 0.203: J1.33 16.92,9.1 17.47,9.65 R5.2
N$10  (1 unrouted)
  Bottom 0.203: U1.1 | R6.1 20.32,7.14 20,7.46 18.94,7.46 18.57,7.83 18.57,10.49
N$11  (via drill 0.25)
  Top 0.203: J1.32 17.42,3.97 v17.28,4.11
  Bottom 0.203: v17.28,4.11 17.53,3.87 17.53,2.97 17.91,2.59 R6.2
N$12  (via drill 0.25)
  Top 0.203: R7.1 17.86,8.93 v17.75,9.03
  Bottom 0.203: U1.2 17.75,10.6 v17.75,9.03
N$13
  Top 0.203: U8.7 30.25,6.83 30.61,7.19 30.61,8.76 31.15,9.3 J3.3
N$14
  Top 0.203: J1.31 17.42,8.23 R7.2
N$15
  Top 0.305: R1.2 25.45,15.51 U5.2
N$16
  Top 0.305: R1.1 26.61,18.57 OSC1.3
N$17  (via drill 0.25)  (1 unrouted)
  Top 0.203: v11.94,9.35 12.2,9.61 U9.7
  Bottom 0.254: J2.2 11.76,9.17 v11.94,9.35
N$18
  Top 0.203: U8.6 30.59,6.43 31.06,6.91 31.06,7.7 31.42,8.05 J3.2
N$19
  Top 0.203: U8.2 26.01,6.83 25.68,7.16 25.04,7.16 24.97,7.09 24.97,6.14 J1.1
N$20
  Top 0.203: U8.3 27.77,6.43 27.03,5.69 27.03,2.03 26.44,1.45 25.15,1.45 24.92,1.67 J1.2
N$21
  Top 0.61: C22.2 U10.4
N$22
  Bottom 0.203: U1.3 17.17,8.11 17.69,7.59 18.31,7.59 18.79,7.1 19.62,7.1 19.84,6.88 R15.1
N$23
  Top 0.61: U4.4 R9.2 34.99,20.08 34.78,20.28 R8.1
N$24  (via drill 0.25)
  Top 0.203: J1.30 17.92,4.62 v17.75,4.79
  Bottom 0.203: v17.75,4.79 17.75,5.56 18.16,5.97 R15.2
N$25
  Top 0.305: R2.1 U5.4
N$26  (via drill 0.25)
  Top 0.203: R2.2 22.48,11.94 16.03,11.94 v15.8,11.71
  Bottom 0.203: v15.8,11.71 15.77,11.68 15.77,11.22 U1.5
N$27
  Bottom 0.508: S1.3 6.36,22.19
  Bottom 0.61: 6.36,22.19 U6.3 | S1.4 S1.3
N$28  (1 unrouted)
N$29  (1 unrouted)
N$30
  Bottom 0.508: R11.1 3.01,19.67 1.28,21.4 LED1.A
N$31  (via drill 0.25)
  Top 0.203: J1.44 14.37,2.54 14.37,3.59 14.13,3.83 v14.13,4.56
  Bottom 0.203: R12.2 14.13,5.03 v14.13,4.56
N$32  (via drill 0.25)
  Top 0.203: R13.2 24.92,23.22 22.55,23.22 v21.59,22.25
  Bottom 0.203: v21.59,22.25 21.11,22.25 20.68,21.82 U1.27
N$33
  Bottom 0.203: R14.2 27.89,23.24 27.51,22.86 20.9,22.86 19.97,21.93 U1.26
N$34  (via drill 0.25)
  Top 0.61: D1.A 10.24,2.16 v10.31,2.08
  Bottom 0.61: v10.31,2.08 11.1,2.08 13.01,3.99 J2.1
N$35
  Top 0.203: U9.2 13.76,9.63 15.22,9.63 16.81,11.21 20.42,11.21 | 20.55,11.21 20.42,11.21 | J1.15 21.42,6.99 21.14,7.27 21.14,7.97 22.24,9.07 22.24,10.41 21.44,11.21 20.42,11.21
N$36  (via drill 0.25)
  Top 0.203: v22.35,4.16 21.73,3.55 21.67,3.55 21.42,3.3 J1.16 | U9.3 15.02,10 16.58,11.57 21.6,11.57 23.62,9.55 v23.62,9.42
  Bottom 0.203: v22.35,4.16 22.35,6.88 22.17,7.06 22.17,7.57 22.55,7.95 22.55,8.89 23.09,9.42 v23.62,9.42
N$37  (1 unrouted)
N$38  (1 unrouted)
N$39
  Bottom 0.406: J6.2 J6.1 | D2.A 7.86,7.5
  Bottom 0.61: 7.86,7.5 J6.1
N$40  (via drill 0.25)
  Top 0.203: R17.1 20.85,8.69 21.51,9.34 21.51,10.14 21.15,10.5 17.17,10.5 15.99,9.31 15.99,8.73 16.04,8.67 16.04,7.86 v15.84,7.66
  Bottom 0.203: v15.84,7.66 15.84,7.99 16.04,8.19 16.04,8.67 15.7,9.01 15.41,9.01 14.37,10.06 U1.7
N$41
  Top 0.203: 17.97,6.14 J1.29 17.92,7.33 18.44,7.85 18.44,8.33 R17.2
N$42  (via drill 0.25)
  Top 0.203: R21.1 9.25,11.05 v9.27,11.02
  Bottom 0.203: v9.27,11.02 10.95,11.02 11.99,12.06 U1.8
N$43
  Top 0.203: J1.26 18.92,1.09 18.87,1.04 7.01,1.04 6.63,1.42 6.63,11 6.68,11.05 R21.2
N$44  (via drill 0.25)
  Top 0.203: R22.1 7.01,11.68 v6.98,11.71
  Bottom 0.203: v6.98,11.71 10.92,11.71 12.01,12.8 14.39,12.8 U1.9
N$45  (via drill 0.65 layers 1-2)
  Top 0.203: J1.25 18.92,4.19 v18.7,3.97 | v12.09,5.87 11.15,6.81 10.58,6.81 10.11,7.28 10.11,11.68 R22.2
  Route2 0.203: v18.7,3.97 18.34,4.34 18.34,5.03 17.95,5.42 12.55,5.42 v12.09,5.87
N$46  (via drill 0.25)
  Top 0.203: R23.1 8.18,12.78 7.57,13.39 v7.42,13.39
  Bottom 0.203: v7.42,13.39 11.85,13.39 11.96,13.28 12.59,13.28 12.78,13.46 U1.10
N$47
  Top 0.203: J1.24 19.42,0.83 19.28,0.69 6.81,0.69 6.27,1.22 6.27,12.32 R23.2
N$48  (via drill 0.25)
  Top 0.203: R24.1 v12.19,13.87 v12.2,13.86
  Bottom 0.203: v12.2,13.86 12.5,14.16 U1.11
N$49  (via drill 0.25)
  Top 0.203: v15.46,8.43 15.46,9.29 17.03,10.85 21.29,10.85 21.86,10.29 21.86,9.2 20.76,8.09 19.75,8.09 19.42,7.76 J1.23 | J1.23 19.52,6.19 J1.23 | v12.09,11.07 12.09,12.01 11.05,13.06 R24.2
  Bottom 0.203: v15.46,8.43 15.46,8.47 12.85,11.07 v12.09,11.07
N$52  (via drill 0.25)
  Top 0.203: R18.1 18.01,22.53 18.57,21.97 v18.57,20.73
  Bottom 0.203: v18.57,20.73 v18.57,20.72 U1.24
N$53
  Top 0.203: J1.39 15.43,7.07 15.33,7.17 10.72,7.17 10.55,7.35 10.55,11.88 10.18,12.24 9.04,12.24 8.92,12.37 R19.2
P1P8V  (via drill 0.25, 0.65 layers 1-2)  (8 unrouted)
  Top 0.203: U9.1 14.07,9.2 14.07,7.98 v14.1,7.95 | U8.1 27.24,7.23 25.98,8.48 25.98,9.37 v25.88,9.47 | C36.1 29.06,6.03 U8.5 | R18.2 14.98,22.42 C7.1 v14.98,20.78 v14.99,20.78 | 13.89,19.1 13.87,19.08 v12.96,19.08 12.09,19.94 U7.5 | U11.1 14.93,15.35 v14.95,15.33 15.83,15.33 | 15.83,15.33 16.18,15.67 | 16.18,15.67 | 16.18,15.67 16.18,16.23 | C35.1 16.18,14.98 15.83,15.33
  Top 0.254: v13.89,17.65 13.89,19.1 13.89,19.68 C8.1 13.84,20.7 14.71,21.56 C7.1 | 16.2,16.23 C34.1 16.2,16.23 | C35.1 16.15,14.45 15.5,14.45 v15.49,14.46 | 16.2,16.23 16.18,16.23 15.72,16.23 v15.54,16.05 | C36.1 29.06,4.8 v28.7,4.44
  Top 0.305: J1.46 13.92,3.41 13.11,4.22 13.11,4.61 v13.06,4.61 | U5.5 C15.1 | U9.5 C41.1 12.83,11.86 v12.95,11.99 | U11.5 C43.1 13.49,17.65 v13.89,17.65
  Top 0.61: C21.1 7.42,24.54 U3.5 9.25,23.13 | 9.25,23.13 v9.25,23.11 | 9.25,23.13 11.92,23.13 12.36,22.7 12.36,22.4 R10.2 12.36,21.89 C31.2 12.09,20.79 U7.5 | v25.88,9.47 26.48,10.07 U5.5
  Bottom 0.203: v14.99,20.78 15.07,20.69 U1.19 | U1.18 12.97,19.06 v12.96,19.08
  Bottom 0.254: U1.18 | U1.14 14.47,16.21 15.54,16.21 v15.54,16.05 | U1.12 14.52,14.76 14.96,14.76 14.96,14.87 15.38,14.45 15.39,14.46 v15.49,14.46
  pour Route2 (isolate 0.254): 7.24,23.93 7.24,22.33 9.27,22.33 9.27,17.17 12.32,17.17 12.32,7.49 10.59,7.49 10.59,3.81 14.73,3.81 14.73,4.95 23.34,4.95 23.34,3.8 30.78,3.71 30.78,6.05 26.54,6.05 26.54,10.11 16.15,10.11 16.15,19.51 24.05,19.51 24.05,23.93
P2P8V  (via drill 0.25, 0.65 layers 1-2)  (7 unrouted)
  Top 0.203: v16.48,12.6 17.07,12.6 17.15,12.68 C14.1 17.49,13.31 v18.01,12.79 | 21.79,14.38 21.72,14.3 C13.1 v22.43,12.65 | C9.1 21.77,17.53 22,17.75 23.49,17.75 23.82,17.42 v23.82,17.09
  Top 0.254: C11.1 21.77,14.45 C12.1 21.79,14.38 v22.43,14.38 | C10.1 C11.1 | C11.1 21.84,15.21 v22.45,15.21 | C10.1 v22.44,16.13 | C10.1 C9.1 21.82,17.02 v22.4,17.02
  Top 0.61: 33.09,19.04 C26.2 | R8.2 | R8.2 33.08,22.39 v33.1,22.4 | U4.5 33.09,19.04 | 33.09,19.04 C26.2 | C26.2 R8.2 | R8.2
  Bottom 0.254: v22.43,12.65 22.54,12.76 U1.40 | v22.43,14.38 22.64,14.16 U1.38 | v22.45,15.21 22.8,14.86 U1.37 | v22.44,16.13 22.64,15.93 22.64,15.92 23,15.56 U1.36 | v22.4,17.02 23.37,17.02 U1.34 | v16.48,12.6 U1.4
  pour Route2 (isolate 0.254): 28.83,26.64 34.87,26.64 34.87,12.73 30.81,12.73 30.81,6.35 26.85,6.35 26.85,10.41 16.48,10.41 16.48,19.05 19.05,19.05 19.05,11.25 27.64,11.25 27.64,7.57 29.64,7.57 29.64,12.75 22.61,12.75 22.61,17.83 28.83,17.83
P3P3V  (via drill 0.25, 0.65 layers 1-2)  (3 unrouted)
  Top 0.203: C37.1 29.08,7.23 U8.8 | U11.8 12.72,15.35
  Top 0.254: C44.1 U11.8 | 12.72,15.35 v11.16,15.35 | C37.1 29.08,9 v28.63,9.35
  Top 0.305: v27.94,21.01 27.94,20.93 27.48,20.47 | 27.48,20.47 27.48,20.09 C16.1 | OSC1.4 27.47,20.46 27.48,20.47 | v11.33,8.51 C42.1 12.83,8.53 U9.8 | C44.1 | v11.16,15.35 v11.15,15.34
  Top 0.508: v5.05,25.27 5.05,24.93 v4.26,24.14 | J5.1 7.6,19.48 | 7.6,19.48 v7.62,19.46 | 7.6,19.48 7.62,19.5 C27.2 7.62,21.63 U3.4
  Top 0.61: OSC1.1 OSC1.4 26.6,20.46 | U10.5 C24.2 5.24,13.37 v5.51,13.64
  Bottom 0.508: 5.03,25.25 v5.05,25.27
  Bottom 0.61: U6.4 6.36,24.84 5.93,24.41 C30.2 5.03,25.25
  pour Route2 (isolate 0.254): -0.15,26.64 28.52,26.64 28.52,18.19 22.3,18.19 22.3,12.42 29.34,12.42 29.34,7.87 27.94,7.87 27.94,11.56 19.35,11.56 19.35,19.15 24.36,19.15 24.36,24.23 6.86,24.23 6.86,22.02 8.79,22.02 8.79,16.84 12.01,16.84 12.01,7.8 10.59,7.8 10.59,11.4 7.75,11.4 7.75,12.62 4.52,12.62 4.52,21.64 -0.15,21.64
P5V  (via drill 0.25, 0.65 layers 1-2)  (1 unrouted)
  Top 0.305: v12.09,2.49 J1.50 J1.48
  Top 0.508: 1.29,20.09 v1.32,20.12
  Top 0.61: v1.29,17.7 1.29,20.09 | C25.2 U4.1 | C25.2 34.47,13.72 35,14.25 34.99,14.26 U4.3 | C25.2 33.08,11.61 v32.38,10.92 | v9.19,6.96 10.24,5.92 D1.C | v2.67,11.38 2.67,10.28 C23.2 2.64,8.92 U10.1 | U10.3 v2.65,5.44 v2.64,5.44 | v9.22,10.03 9.22,8.92 v9.25,8.89
  Bottom 0.508: 1.4,18.68 R11.2 | 1.31,17.72 v1.29,17.7 | C38.+ 1.31,16.29
  Bottom 0.61: R11.2 1.31,17.72 1.31,16.29 | D2.C 8.17,10.03 v9.22,10.03
  pour Route2: 35.18,26.64 35.18,12.37 31.11,12.37 31.11,3.4 23.04,3.36 23.04,4.6 15.06,4.6 15.06,3.48 10.29,3.48 10.29,11.1 7.44,11.1 7.44,12.29 4.22,12.29 4.22,21.31 -0.15,21.31 -0.15,-0.23 38.05,-0.23 38.05,26.64
PIXCLK  (via drill 0.25)  (1 unrouted)
  Top 0.203: R19.1 10.16,13.57 10.16,14.48 11.87,14.48 v12.12,14.72
  Bottom 0.203: v12.12,14.72 12.14,14.75 12.77,14.75 13.58,15.56 U1.13
SLA_RESET_BAR  (via drill 0.25, 0.65 layers 1-2)
  Top 0.203: v21.92,7.59 J1.13 | v16.2,20.37 16.2,21.44 v16.18,21.46 | R10.1 9.37,22.15 v8.86,21.64 8.86,20.87 U7.1
  Route2 0.203: v21.92,7.59 21.4,7.08 15.55,7.08 14.9,7.73 14.9,8.25 13.75,9.41 13.75,15.97 14.76,16.98 14.76,19.09 16.04,20.37 v16.2,20.37
  Bottom 0.203: v16.18,21.46 16,21.64 v8.86,21.64
STANDBY  (via drill 0.25)
  Top 0.203: J1.9 22.92,7.38 v22.91,7.39 | v23.9,20.37 22.22,20.37 21.21,21.39 v19.25,21.39
  Bottom 0.203: v22.91,7.39 22.91,8.13 23.47,8.69 25.15,8.69 26.49,10.03 26.49,19.68 25.78,20.4 23.93,20.4 v23.9,20.37 | v19.25,21.39 17.53,21.39 17.17,21.03 U1.22